# Altium schematic sheet nRF24L01.SchDoc
size A4
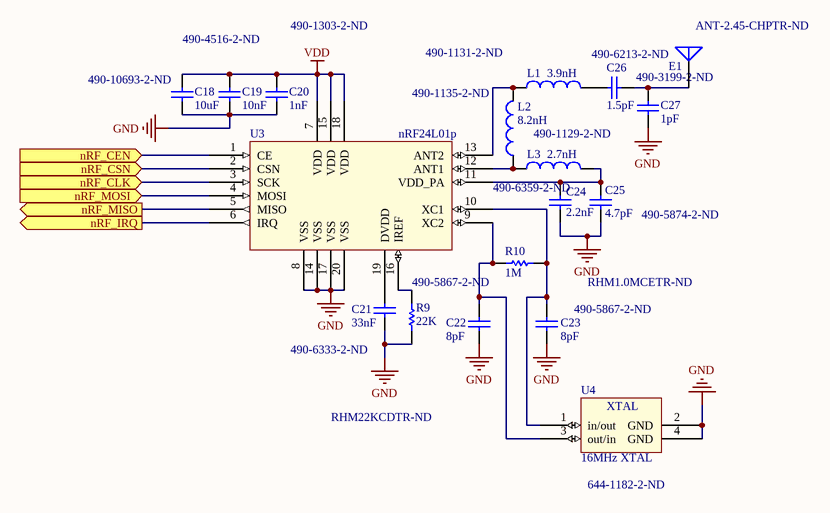
[diagram p0: nRF24L01.SchDoc]

## Parts
C18  value 10uF  Supplier Part Number 1: 490-10693-2-ND  [0402]
C19  value 10nF  Supplier Part Number 1: 490-4516-2-ND  [0402]
C20  value 1nF  Supplier Part Number 1: 490-1303-2-ND  [0402]
C21  value 33nF  Supplier Part Number 1: 490-6333-2-ND  [0402]
C22  value 8pF  Supplier Part Number 1: 490-5867-2-ND  [0402]
C23  value 8pF  Supplier Part Number 1: 490-5867-2-ND  [0402]
C24  value 2.2nF  Supplier Part Number 1: 490-6359-2-ND  [0402]
C25  value 4.7pF  Supplier Part Number 1: 490-5874-2-ND  [0402]
C26  value 1.5pF  Supplier Part Number 1: 490-6213-2-ND  [0402]
C27  value 1pF  Supplier Part Number 1: 490-3199-2-ND  [0402]
E1  Supplier Part Number 1: ANT-2.45-CHPTR-ND  [ANT-2.45-CHP-B]
L1  value 3.9nH  Supplier Part Number 1: 490-1131-2-ND  [0402]
L2  value 8.2nH  Supplier Part Number 1: 490-1135-2-ND  [0402]
L3  value 2.7nH  Supplier Part Number 1: 490-1129-2-ND  [0402]
R9  value 22K  Supplier Part Number 1: RHM22KCDTR-ND  [0402]
R10  value 1M  Supplier Part Number 1: RHM1.0MCETR-ND  [0402]
U3  nRF24L01p  [Component_nRF]
U4  16MHz XTAL  Supplier Part Number 1: 644-1182-2-ND  [8Y-16.000MAAV-T]

## Ports
nRF_CEN (in), nRF_CLK (in), nRF_CSN (in), nRF_IRQ (out), nRF_MISO (out), nRF_MOSI (in)

## Nets
GND: C18.1 C19.1 C20.1 C21.1 C22.1 C23.1 C24.1 C25.1 C27.2 R9.1 U3.8(VSS) U3.14(VSS) U3.17(VSS) U3.20(VSS) U4.2(GND) U4.4(GND)
VDD: C18.2 C19.2 C20.2 U3.7(VDD) U3.15(VDD) U3.18(VDD)
nRF_CEN: U3.1(CE) ; port nRF_CEN
nRF_CLK: U3.3(SCK) ; port nRF_CLK
nRF_CSN: U3.2(CSN) ; port nRF_CSN
nRF_IRQ: U3.6(IRQ) ; port nRF_IRQ
nRF_MISO: U3.5(MISO) ; port nRF_MISO
nRF_MOSI: U3.4(MOSI) ; port nRF_MOSI
NetC21_2: C21.2 U3.19(DVDD)
NetC22_2: C22.2 R10.2 U3.9(XC2) U4.3(out/in)
NetC23_2: C23.2 R10.1 U3.10(XC1) U4.1(in/out)
NetC24_2: C24.2 C25.2 L3.2 U3.11(VDD_PA)
NetC26_1: C26.1 C27.1 E1.1(A)
NetC26_2: C26.2 L1.2
NetL1_1: L1.1 L2.2 U3.13(ANT2)
NetL2_1: L2.1 L3.1 U3.12(ANT1)
NetR9_2: R9.2 U3.16(IREF)

## Notes on the sheet
- (in symbol 8Y-16.000MAAV-T) XTAL

## Library data of the parts
C18-C27 = Cap Semi: Capacitor (Semiconductor SIM Model); Published: 8-Jun-2000; LatestRevisionDate: 29-May-2009; LatestRevisionNote: IPC-7351 Footprint Added.; PackageReference: C1206; Publisher: Altium Limited; PackageDescription: Chip Capacitor; Supplier 1: Digi-Key
E1 = Antenna: Generic Antenna; Published: 24-Mar-1999; LatestRevisionDate: 17-Jul-2002; LatestRevisionNote: Re-released for DXP Platform.; PackageReference: PIN1; Publisher: Altium Limited; Supplier 1: Digi-Key
L1-L3 = Inductor: Code_IEC: 1005; Published: 8-Jun-2000; LatestRevisionDate: 29-May-2009; LatestRevisionNote: IPC-7351 Footprint Added.; PackageReference: 0402-A; Publisher: Altium Limited; PackageDescription: Chip Inductor; Code_JEITA: 0402; Supplier 1: Digi-Key
R9 R10 = Res Semi: Semiconductor Resistor; Published: 8-Jun-2000; LatestRevisionDate: 17-Jul-2002; LatestRevisionNote: Re-released for DXP Platform.; PackageReference: AXIAL-0.5; Publisher: Altium Limited; PackageDescription: Axial Device, Thru-Hole; 2 Leads; 0.5 in Pin Spacing; Supplier 1: Digi-Key
U3 = Component_nRF
U4 = 8Y-16.000MAAV-T: SMD 16 MHz XTAL; Supplier 1: Digi-Key